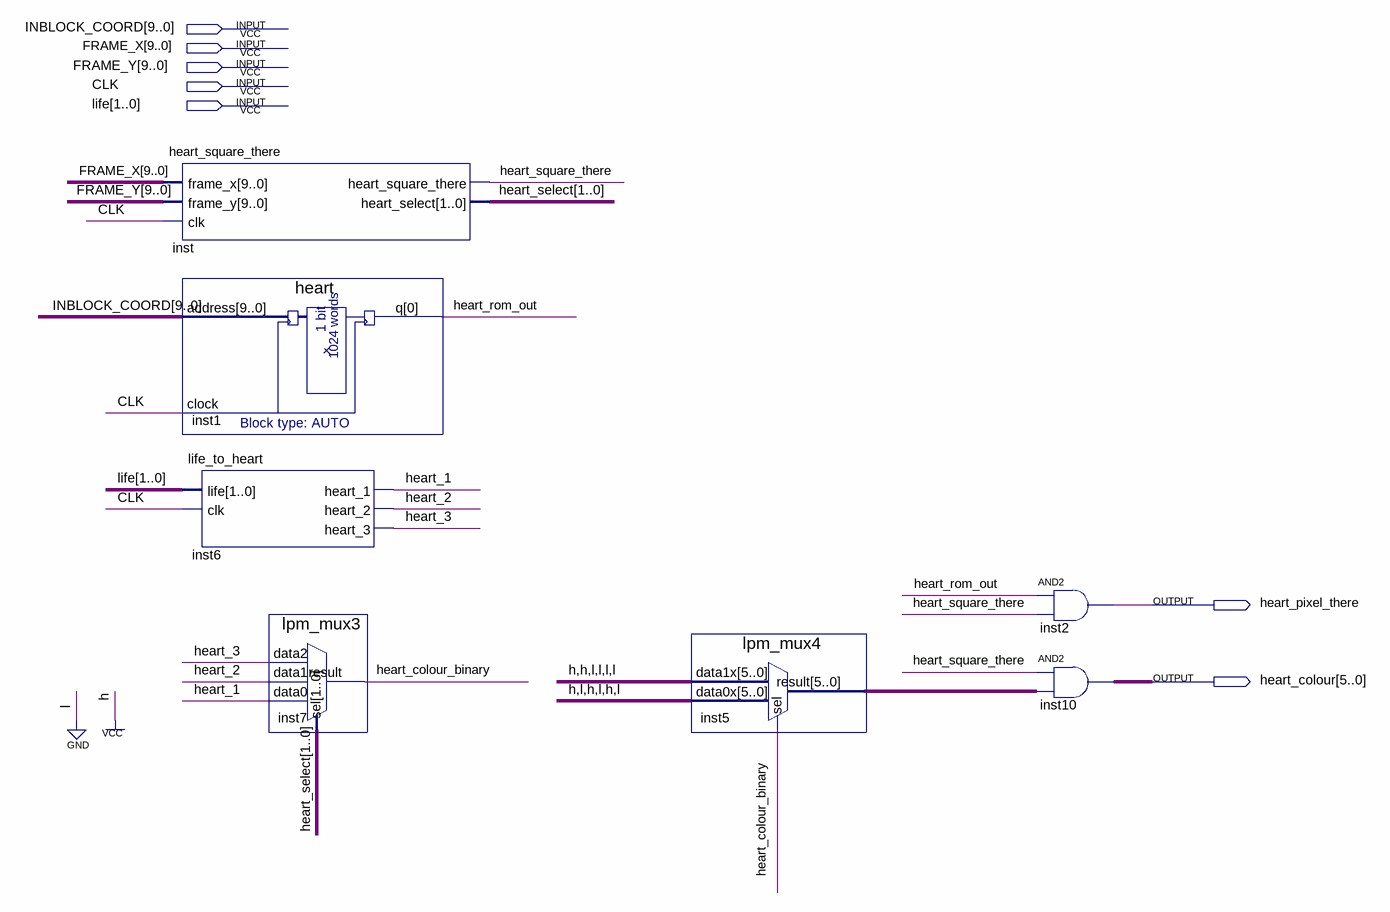
[diagram p0: schematic sheet]
// Quartus schematic heart_display.bdf as structural Verilog: 7 symbols, 7 pins
module heart_display (
  input  [9:0] INBLOCK_COORD,
  input  [9:0] FRAME_X,
  input  [9:0] FRAME_Y,
  input  CLK,
  input  [1:0] life,
  output heart_pixel_there,
  output [5:0] heart_colour
);

  wire heart_1, heart_2, heart_3, heart_colour_binary, heart_rom_out, heart_square_there;
  wire [1:0] heart_select;
  wire [5:0] inst5_result;

  heart_square_there inst (
    .frame_x(FRAME_X), .frame_y(FRAME_Y), .clk(CLK), .heart_square_there(heart_square_there),
    .heart_select(heart_select));
  heart inst1 (.address(INBLOCK_COORD), .clock(CLK), .q(heart_rom_out));
  life_to_heart inst6 (.life(life), .clk(CLK), .heart_1(heart_1), .heart_2(heart_2), .heart_3(heart_3));
  lpm_mux3 inst7 (.data2(heart_3), .data1(heart_2), .data0(heart_1), .sel(heart_select), .result(heart_colour_binary));
  lpm_mux4 inst5 (.data1x(6'b110000), .data0x(6'b101010), .sel(heart_colour_binary), .result(inst5_result));
  and inst2 (heart_pixel_there, heart_rom_out, heart_square_there);
  assign heart_colour = {6{heart_square_there}} & inst5_result;  // AND2 inst10, 6 bits wide
endmodule
